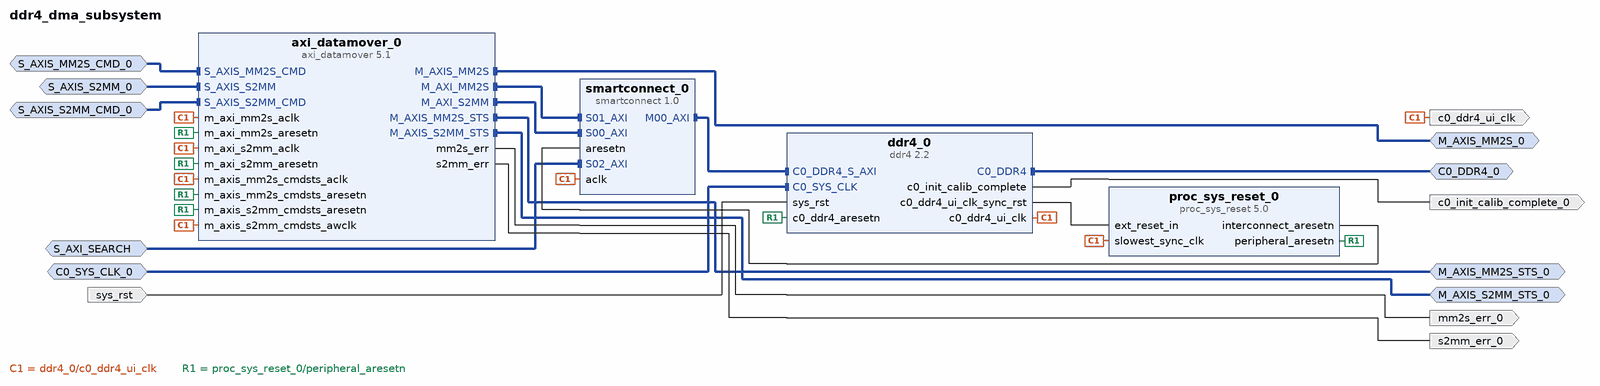
[diagram p0: block diagram of the top level]
# Vivado block design ddr4_dma_subsystem, xcku5p-ffvb676-2-i, Vivado 2025.2
create_bd_design ddr4_dma_subsystem

create_bd_intf_port -mode Slave -vlnv xilinx.com:interface:diff_clock_rtl:1.0 C0_SYS_CLK_0
create_bd_intf_port -mode Master -vlnv xilinx.com:interface:ddr4_rtl:1.0 C0_DDR4_0
create_bd_intf_port -mode Slave -vlnv xilinx.com:interface:axis_rtl:1.0 S_AXIS_S2MM_0
set_property -dict [list \
  CONFIG.FREQ_HZ 333250000 \
  CONFIG.HAS_TKEEP 1 \
  CONFIG.HAS_TLAST 1 \
  CONFIG.HAS_TREADY 1 \
  CONFIG.HAS_TSTRB 0 \
  CONFIG.LAYERED_METADATA undef \
  CONFIG.TDATA_NUM_BYTES 64 \
  CONFIG.TDEST_WIDTH 0 \
  CONFIG.TID_WIDTH 0 \
  CONFIG.TUSER_WIDTH 0 \
] [get_bd_intf_ports S_AXIS_S2MM_0]
create_bd_intf_port -mode Master -vlnv xilinx.com:interface:axis_rtl:1.0 M_AXIS_MM2S_0
set_property -dict {CONFIG.FREQ_HZ 333250000} [get_bd_intf_ports M_AXIS_MM2S_0]
create_bd_intf_port -mode Slave -vlnv xilinx.com:interface:axis_rtl:1.0 S_AXIS_S2MM_CMD_0
set_property -dict [list \
  CONFIG.FREQ_HZ 333250000 \
  CONFIG.HAS_TKEEP 0 \
  CONFIG.HAS_TLAST 0 \
  CONFIG.HAS_TREADY 1 \
  CONFIG.HAS_TSTRB 0 \
  CONFIG.LAYERED_METADATA undef \
  CONFIG.TDATA_NUM_BYTES 9 \
  CONFIG.TDEST_WIDTH 0 \
  CONFIG.TID_WIDTH 0 \
  CONFIG.TUSER_WIDTH 0 \
] [get_bd_intf_ports S_AXIS_S2MM_CMD_0]
create_bd_intf_port -mode Slave -vlnv xilinx.com:interface:axis_rtl:1.0 S_AXIS_MM2S_CMD_0
set_property -dict [list \
  CONFIG.FREQ_HZ 333250000 \
  CONFIG.HAS_TKEEP 0 \
  CONFIG.HAS_TLAST 0 \
  CONFIG.HAS_TREADY 1 \
  CONFIG.HAS_TSTRB 0 \
  CONFIG.LAYERED_METADATA undef \
  CONFIG.TDATA_NUM_BYTES 9 \
  CONFIG.TDEST_WIDTH 0 \
  CONFIG.TID_WIDTH 0 \
  CONFIG.TUSER_WIDTH 0 \
] [get_bd_intf_ports S_AXIS_MM2S_CMD_0]
create_bd_intf_port -mode Master -vlnv xilinx.com:interface:axis_rtl:1.0 M_AXIS_S2MM_STS_0
set_property -dict {CONFIG.FREQ_HZ 333250000} [get_bd_intf_ports M_AXIS_S2MM_STS_0]
create_bd_intf_port -mode Master -vlnv xilinx.com:interface:axis_rtl:1.0 M_AXIS_MM2S_STS_0
set_property -dict {CONFIG.FREQ_HZ 333250000} [get_bd_intf_ports M_AXIS_MM2S_STS_0]
create_bd_intf_port -mode Slave -vlnv xilinx.com:interface:aximm_rtl:1.0 S_AXI_SEARCH
set_property -dict [list \
  CONFIG.ADDR_WIDTH 32 \
  CONFIG.ARUSER_WIDTH 0 \
  CONFIG.AWUSER_WIDTH 0 \
  CONFIG.BUSER_WIDTH 0 \
  CONFIG.DATA_WIDTH 512 \
  CONFIG.FREQ_HZ 333250000 \
  CONFIG.HAS_BRESP 1 \
  CONFIG.HAS_BURST 0 \
  CONFIG.HAS_CACHE 0 \
  CONFIG.HAS_LOCK 0 \
  CONFIG.HAS_PROT 0 \
  CONFIG.HAS_QOS 0 \
  CONFIG.HAS_REGION 0 \
  CONFIG.HAS_RRESP 1 \
  CONFIG.HAS_WSTRB 0 \
  CONFIG.ID_WIDTH 0 \
  CONFIG.MAX_BURST_LENGTH 256 \
  CONFIG.NUM_READ_OUTSTANDING 2 \
  CONFIG.NUM_READ_THREADS 1 \
  CONFIG.NUM_WRITE_OUTSTANDING 2 \
  CONFIG.NUM_WRITE_THREADS 1 \
  CONFIG.PROTOCOL AXI4 \
  CONFIG.READ_WRITE_MODE READ_WRITE \
  CONFIG.RUSER_BITS_PER_BYTE 0 \
  CONFIG.RUSER_WIDTH 0 \
  CONFIG.SUPPORTS_NARROW_BURST 1 \
  CONFIG.WUSER_BITS_PER_BYTE 0 \
  CONFIG.WUSER_WIDTH 0 \
] [get_bd_intf_ports S_AXI_SEARCH]
create_bd_port -dir I -type rst sys_rst
set_property -dict {CONFIG.POLARITY ACTIVE_HIGH} [get_bd_ports sys_rst]
create_bd_port -dir O c0_init_calib_complete_0
create_bd_port -dir O mm2s_err_0
create_bd_port -dir O s2mm_err_0
create_bd_port -dir O -type clk c0_ddr4_ui_clk
set_property -dict {CONFIG.FREQ_HZ 333250000} [get_bd_ports c0_ddr4_ui_clk]

create_bd_cell -type ip -vlnv xilinx.com:ip:smartconnect:1.0 smartconnect_0
set_property -dict {CONFIG.NUM_SI 3} [get_bd_cells smartconnect_0]
create_bd_cell -type ip -vlnv xilinx.com:ip:ddr4:2.2 ddr4_0
set_property -dict [list \
  CONFIG.C0.DDR4_AUTO_AP_COL_A3 false \
  CONFIG.C0.DDR4_DataWidth 32 \
  CONFIG.C0.DDR4_InputClockPeriod 10000 \
  CONFIG.C0.DDR4_MemoryPart MT40A512M16LY-075 \
  CONFIG.Simulation_Mode Unisim \
] [get_bd_cells ddr4_0]
create_bd_cell -type ip -vlnv xilinx.com:ip:axi_datamover:5.1 axi_datamover_0
set_property -dict [list \
  CONFIG.c_dummy 1 \
  CONFIG.c_enable_mm2s_adv_sig 0 \
  CONFIG.c_include_mm2s_dre true \
  CONFIG.c_include_s2mm_dre true \
  CONFIG.c_m_axi_mm2s_data_width 512 \
  CONFIG.c_m_axi_s2mm_data_width 512 \
  CONFIG.c_m_axis_mm2s_tdata_width 512 \
  CONFIG.c_mm2s_btt_used 23 \
  CONFIG.c_mm2s_burst_size 64 \
  CONFIG.c_s2mm_btt_used 23 \
  CONFIG.c_s2mm_burst_size 64 \
  CONFIG.c_s_axis_s2mm_tdata_width 512 \
  CONFIG.c_single_interface 0 \
] [get_bd_cells axi_datamover_0]
create_bd_cell -type ip -vlnv xilinx.com:ip:proc_sys_reset:5.0 proc_sys_reset_0

# ---- connections ----

connect_bd_intf_net -intf_net C0_SYS_CLK_0_1 [get_bd_intf_ports C0_SYS_CLK_0] [get_bd_intf_pins ddr4_0/C0_SYS_CLK]
connect_bd_intf_net -intf_net S_AXIS_MM2S_CMD_0_1 [get_bd_intf_ports S_AXIS_MM2S_CMD_0] [get_bd_intf_pins axi_datamover_0/S_AXIS_MM2S_CMD]
connect_bd_intf_net -intf_net S_AXIS_S2MM_0_1 [get_bd_intf_ports S_AXIS_S2MM_0] [get_bd_intf_pins axi_datamover_0/S_AXIS_S2MM]
connect_bd_intf_net -intf_net S_AXIS_S2MM_CMD_0_1 [get_bd_intf_ports S_AXIS_S2MM_CMD_0] [get_bd_intf_pins axi_datamover_0/S_AXIS_S2MM_CMD]
connect_bd_intf_net [get_bd_intf_ports S_AXI_SEARCH] [get_bd_intf_pins smartconnect_0/S02_AXI]
connect_bd_intf_net [get_bd_intf_ports M_AXIS_MM2S_0] [get_bd_intf_pins axi_datamover_0/M_AXIS_MM2S]
connect_bd_intf_net [get_bd_intf_ports M_AXIS_MM2S_STS_0] [get_bd_intf_pins axi_datamover_0/M_AXIS_MM2S_STS]
connect_bd_intf_net [get_bd_intf_ports M_AXIS_S2MM_STS_0] [get_bd_intf_pins axi_datamover_0/M_AXIS_S2MM_STS]
connect_bd_intf_net [get_bd_intf_pins axi_datamover_0/M_AXI_MM2S] [get_bd_intf_pins smartconnect_0/S01_AXI]
connect_bd_intf_net [get_bd_intf_pins axi_datamover_0/M_AXI_S2MM] [get_bd_intf_pins smartconnect_0/S00_AXI]
connect_bd_intf_net [get_bd_intf_ports C0_DDR4_0] [get_bd_intf_pins ddr4_0/C0_DDR4]
connect_bd_intf_net [get_bd_intf_pins smartconnect_0/M00_AXI] [get_bd_intf_pins ddr4_0/C0_DDR4_S_AXI]
connect_bd_net [get_bd_pins axi_datamover_0/mm2s_err] [get_bd_ports mm2s_err_0]
connect_bd_net [get_bd_pins axi_datamover_0/s2mm_err] [get_bd_ports s2mm_err_0]
connect_bd_net [get_bd_pins ddr4_0/c0_ddr4_ui_clk] \
  [get_bd_pins smartconnect_0/aclk] [get_bd_pins proc_sys_reset_0/slowest_sync_clk] \
  [get_bd_pins axi_datamover_0/m_axi_mm2s_aclk] [get_bd_pins axi_datamover_0/m_axis_mm2s_cmdsts_aclk] \
  [get_bd_pins axi_datamover_0/m_axi_s2mm_aclk] [get_bd_pins axi_datamover_0/m_axis_s2mm_cmdsts_awclk] \
  [get_bd_ports c0_ddr4_ui_clk]
connect_bd_net [get_bd_pins ddr4_0/c0_ddr4_ui_clk_sync_rst] [get_bd_pins proc_sys_reset_0/ext_reset_in]
connect_bd_net [get_bd_pins ddr4_0/c0_init_calib_complete] [get_bd_ports c0_init_calib_complete_0]
connect_bd_net [get_bd_pins proc_sys_reset_0/interconnect_aresetn] [get_bd_pins smartconnect_0/aresetn]
connect_bd_net [get_bd_pins proc_sys_reset_0/peripheral_aresetn] \
  [get_bd_pins axi_datamover_0/m_axi_mm2s_aresetn] [get_bd_pins axi_datamover_0/m_axis_mm2s_cmdsts_aresetn] \
  [get_bd_pins axi_datamover_0/m_axi_s2mm_aresetn] [get_bd_pins axi_datamover_0/m_axis_s2mm_cmdsts_aresetn] \
  [get_bd_pins ddr4_0/c0_ddr4_aresetn]
connect_bd_net [get_bd_ports sys_rst] [get_bd_pins ddr4_0/sys_rst]

# ---- address map ----
assign_bd_address -offset 0x00000000 -range 2G -target_address_space [get_bd_addr_spaces axi_datamover_0/Data_MM2S] [get_bd_addr_segs ddr4_0/C0_DDR4_MEMORY_MAP/C0_DDR4_ADDRESS_BLOCK]
assign_bd_address -offset 0x00000000 -range 2G -target_address_space [get_bd_addr_spaces axi_datamover_0/Data_S2MM] [get_bd_addr_segs ddr4_0/C0_DDR4_MEMORY_MAP/C0_DDR4_ADDRESS_BLOCK]
assign_bd_address -offset 0x00000000 -range 2G -target_address_space [get_bd_addr_spaces S_AXI_SEARCH] [get_bd_addr_segs ddr4_0/C0_DDR4_MEMORY_MAP/C0_DDR4_ADDRESS_BLOCK]

validate_bd_design
save_bd_design
